# Altium schematic sheet Sheet3.SchDoc
size A4
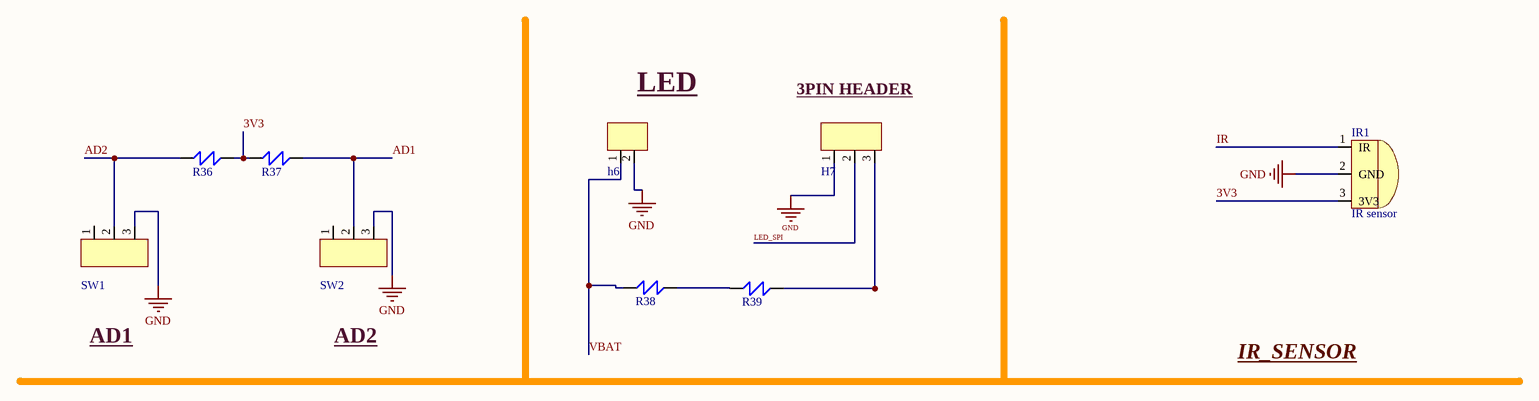
[diagram p0: Sheet3.SchDoc]

## Parts
h6  HEADER/2mm  [Header2]  (value not drawn)
H7  HEADER  [header3]  (value not drawn)
IR1  IR sensor  [IR SENSOR]
R36  4.7K  [R_22K]  (value not drawn)
R37  4.7K  [R_22K]  (value not drawn)
R38  22K  [R_22R]  (value not drawn)
R39  22K  [R_22R]  (value not drawn)
SW1  B50KS  [VR2/50K]  (value not drawn)
SW2  B50KS  [VR2/50K]  (value not drawn)

## Nets
GND: h6.2 H7.1 IR1.2(GND) SW1.3 SW2.3
3V3: IR1.3(3V3) R36.1 R37.2
AD1: R37.1 SW2.2
AD2: R36.2 SW1.2
IR: IR1.1(IR)
LED_SPI: H7.2
VBAT: h6.1 R38.2
NetH7_3: H7.3 R39.1
NetR38_1: R38.1 R39.2

Not connected (* = marked no-connect by the designer): SW1 1; SW2 1

## Notes on the sheet
- (near h6) LED
- (near H7) 3PIN HEADER
- AD1
- AD2
- IR_SENSOR

## Library data of the parts
h6 = HEADER/2mm: 2pin / 2mm
H7 = HEADER/3PIN: HEADER 2MM 3PIN
R36 R37 = RES_1: 4.7K SMD Resistance
R38 R39 = RES_15: 22R SMD Resistance